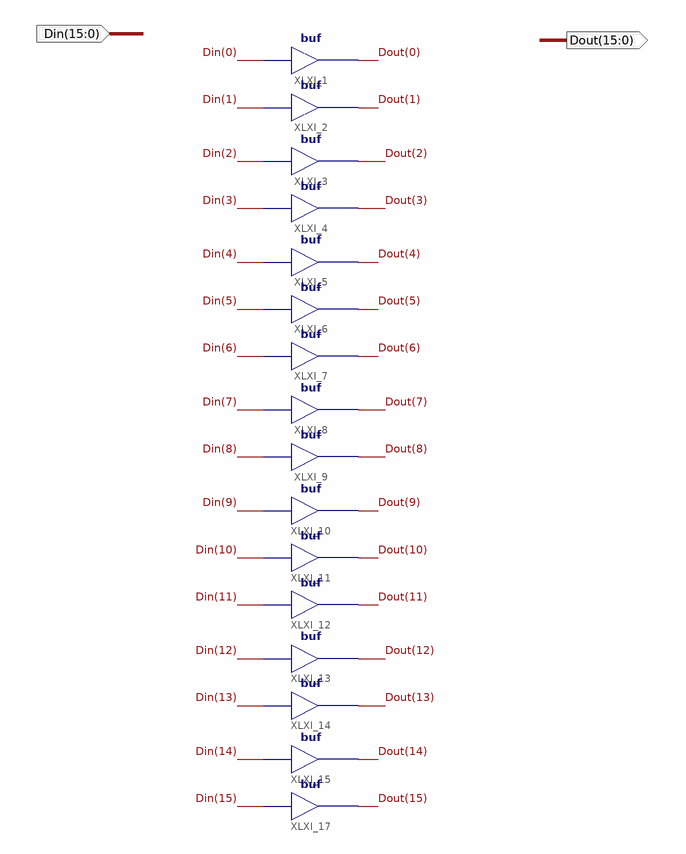
[diagram p0: schematic sheet 1]
// Xilinx ISE schematic BUF16.sch (spartan2) as structural Verilog: 16 symbols, 2 ports
module BUF16 (
  input  [15:0] Din,
  output [15:0] Dout
);

  buf XLXI_1 (Dout[0], Din[0]);
  buf XLXI_2 (Dout[1], Din[1]);
  buf XLXI_3 (Dout[2], Din[2]);
  buf XLXI_4 (Dout[3], Din[3]);
  buf XLXI_5 (Dout[4], Din[4]);
  buf XLXI_6 (Dout[5], Din[5]);
  buf XLXI_7 (Dout[6], Din[6]);
  buf XLXI_8 (Dout[7], Din[7]);
  buf XLXI_9 (Dout[8], Din[8]);
  buf XLXI_10 (Dout[9], Din[9]);
  buf XLXI_11 (Dout[10], Din[10]);
  buf XLXI_12 (Dout[11], Din[11]);
  buf XLXI_13 (Dout[12], Din[12]);
  buf XLXI_14 (Dout[13], Din[13]);
  buf XLXI_15 (Dout[14], Din[14]);
  buf XLXI_17 (Dout[15], Din[15]);
endmodule
